# Altium schematic sheet opcouplers.SchDoc
size A4
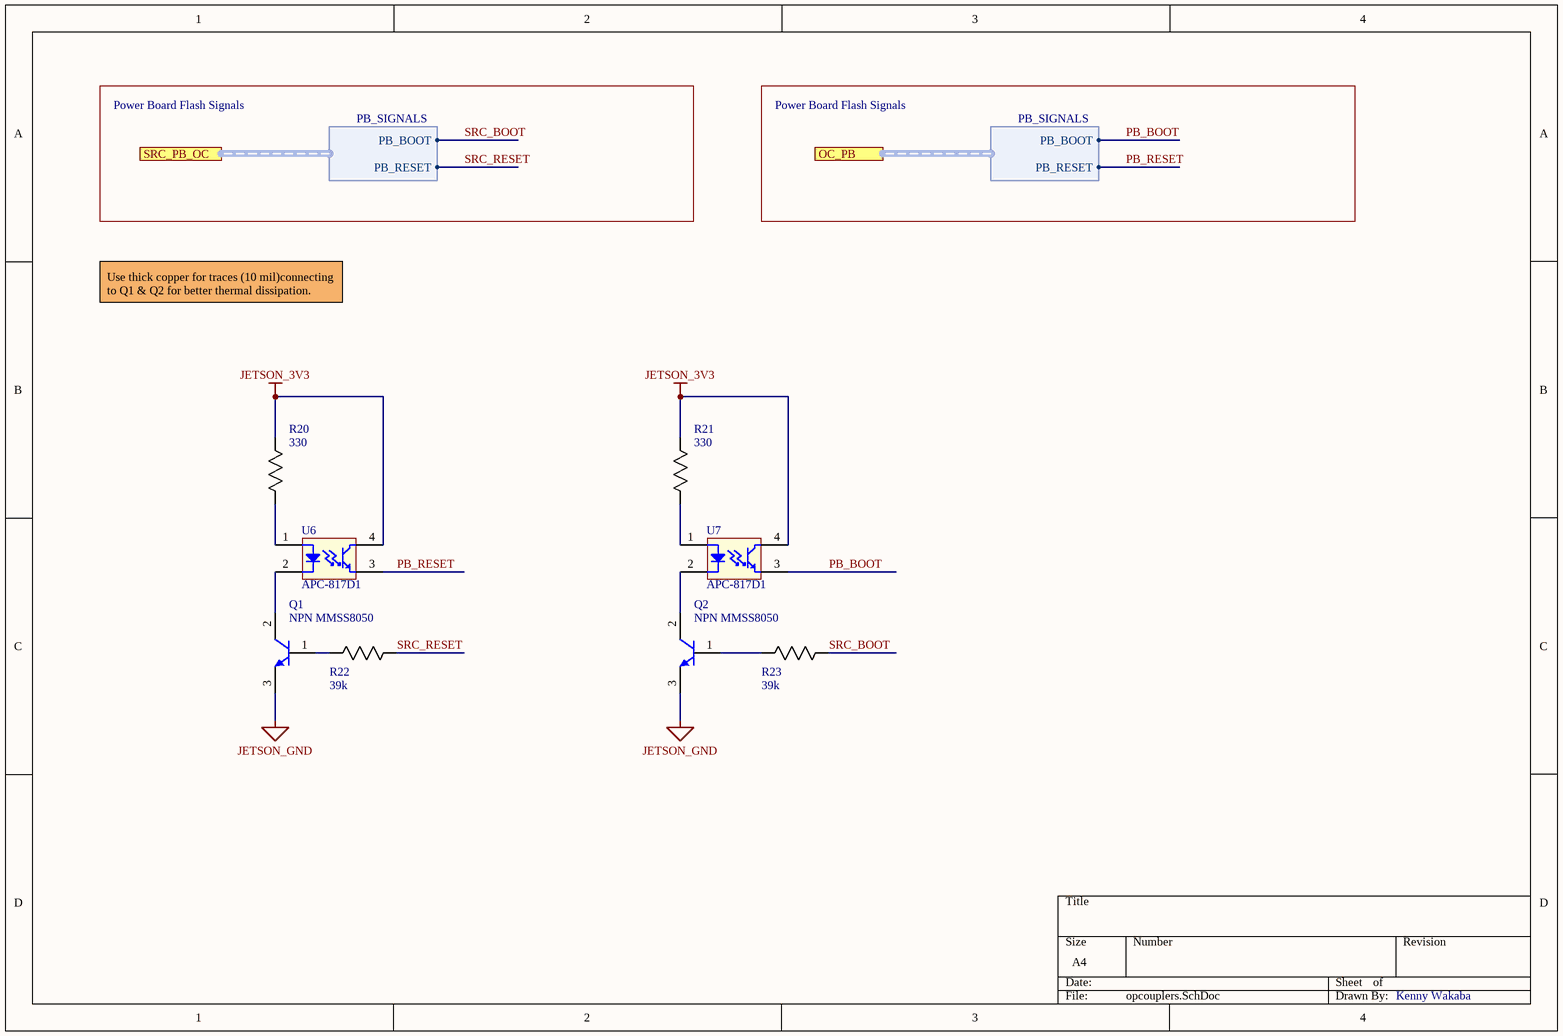
[diagram p0: opcouplers.SchDoc]

## Parts
Q1  NPN MMSS8050  [SOT95P237X112-3N]
Q2  NPN MMSS8050  [SOT95P237X112-3N]
R20  330  [0603]
R21  330  [0603]
R22  39k  [0603]
R23  39k  [0603]
U6  APC-817D1  [APC-817D1]
U7  APC-817D1  [APC-817D1]

## Ports
OC_PB (harness PB_SIGNALS), SRC_PB_OC (harness PB_SIGNALS)

## Harnesses
PB_SIGNALS: PB_BOOT, PB_RESET

## Nets
JETSON_3V3: R20.2(R2) R21.2(R2) U6.4 U7.4
JETSON_GND: Q1.3(E) Q2.3(E)
PB_BOOT: U7.3 ; port OC_PB.PB_BOOT
PB_RESET: U6.3 ; port OC_PB.PB_RESET
SRC_BOOT: R23.1(R1) ; port SRC_PB_OC.PB_BOOT
SRC_RESET: R22.1(R1) ; port SRC_PB_OC.PB_RESET
NetQ1_1: Q1.1(B) R22.2(R2)
NetQ1_2: Q1.2(C) U6.2
NetQ2_1: Q2.1(B) R23.2(R2)
NetQ2_2: Q2.2(C) U7.2
NetR20_1: R20.1(R1) U6.1
NetR21_1: R21.1(R1) U7.1

## Notes on the sheet
- Power Board Flash Signals
- Use thick copper for traces (10 mil)connecting to Q1 & Q2 for better thermal dissipation.
- Kenny Wakaba

## Library data of the parts
Q1 Q2 = N_BJT MMSS8050: Bipolar (BJT) Transistor NPN 25 V 1.5 A 100MHz 625 mW Surface Mount SOT-23; Part Number: N_BJT MMSS8050; Supplier 1: Digi-Key; Supplier Part Number 1: MMSS8050-H-TPMSTR-ND; Supplier URL 1: https://www.digikey.ca/en/products/detail/micro-commercial-co/MMSS8050-H-TP/2696476
R20 R21 = RES 330.0 1/8W - 5%: Default Resistor Symbol; Manufacturer Part Number 1: RMCF0603JT330R; Power (Watts): 0.125W; Tolerance: 5%; Package: 0805; Value: 330; Part Number: RES 330.0 1/8W - 5%; Supplier 1: Digi-Key; Supplier Part Number 1: RMCF0603JT330RCT-ND; Supplier URL 1: https://www.digikey.ca/en/products/detail/stackpole-electronics-inc/RMCF0603JT330R/1757998
R22 R23 = RES 39k 1/8W: Default Resistor Symbol; Manufacturer Part Number 1: CRGCQ0603F39K; Power (Watts): 0.125W; Tolerance: 1%; Package: 0805; Value: 39k; Part Number: RES 39k 1/8W; Supplier 1: Digi-Key; Supplier Part Number 1: A129707CT-ND; Supplier URL 1: https://www.digikey.ca/en/products/detail/te-connectivity-passive-product/CRGCQ0603F39K/8576309?s=N4IgTCBcDaIIIEYwE4DsAGVBhAKiAugL5A; Manufacturer Part Number 2: CRG0805F39K; Supplier 2: Digi-Key; Supplier Part Number 2: A126366CT-ND; Supplier URL 2: https://www.digikey.ca/en/products/detail/te-connectivity-passive-product/CRG0805F39K/2380898?s=N4IgTCBcDaIIIEYwDYDMzkGEAqIC6AvkA; Tolerance 2: 1%
U6 U7 = APC-817D1: DIP4, DC Input, Optocoupler; Part Number: APC-817D1; Supplier 1: Digi-Key; Supplier Part Number 1: 2007-APC-817D1-SLCT-ND; Supplier URL 1: https://www.digikey.ca/en/products/detail/american-bright-optoelectronics-corporation/APC-817D1-SL/16273156